# Altium project Cheeta.PrjPcb
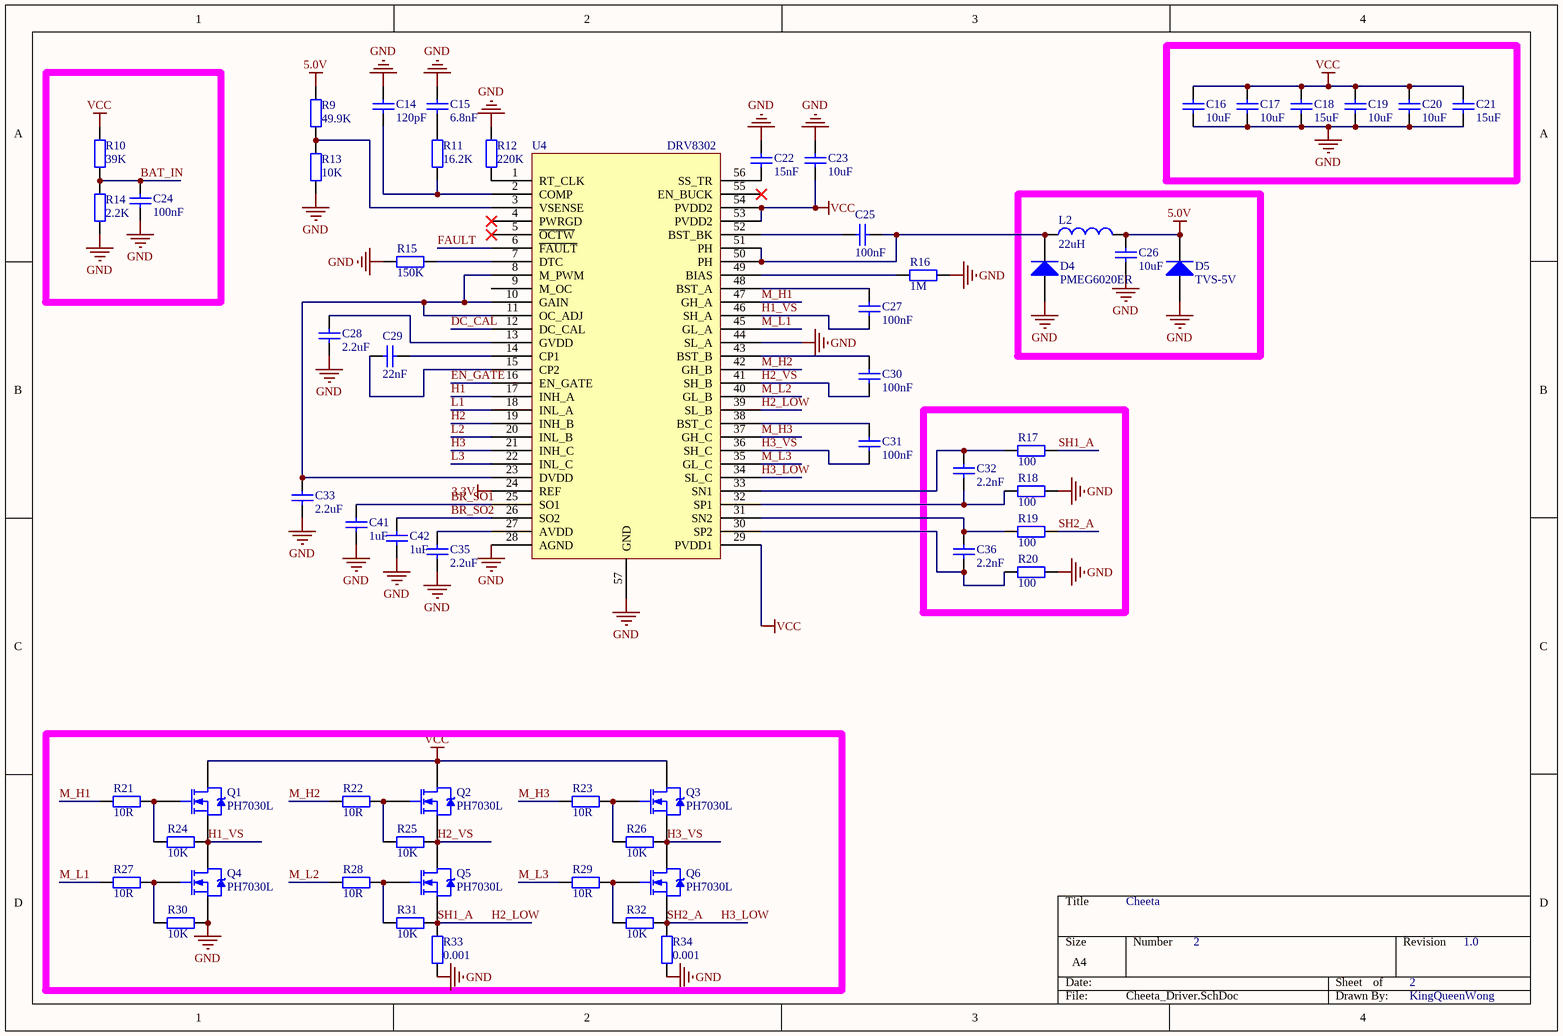
[diagram p0: Cheeta_Driver.SchDoc]
2 sheets, 120 parts. Net scope: global (net labels, ports and power ports of the same name join across sheets).
Board file: Cheeta.PcbDoc
Sheets:
  Cheeta_Driver.SchDoc
  Cheeta_Controller.SchDoc

## Sheet Cheeta_Driver.SchDoc
size A4

### Parts
C14  value 120pF  [0603C]  (hidden comment: Cap)
C15  value 6.8nF  [0603C]  (hidden comment: Cap)
C16  value 10uF  [C1206]  (hidden comment: Cap)
C17  value 10uF  [C1206]  (hidden comment: Cap)
C18  value 15uF  [2220]  (hidden comment: Cap)
C19  value 10uF  [C1206]  (hidden comment: Cap)
C20  value 10uF  [C1206]  (hidden comment: Cap)
C21  value 15uF  [2220]  (hidden comment: Cap)
C22  value 15nF  [0603C]  (hidden comment: Cap)
C23  value 10uF  [C1206]  (hidden comment: Cap)
C24  value 100nF  [0603C]  (hidden comment: Cap)
C25  value 100nF  [0603C]  (hidden comment: Cap)
C26  value 10uF  [C1210]  (hidden comment: Cap)
C27  value 100nF  [0603C]  (hidden comment: Cap)
C28  value 2.2uF  [0603C]  (hidden comment: Cap)
C29  value 22nF  [0603C]  (hidden comment: Cap)
C30  value 100nF  [0603C]  (hidden comment: Cap)
C31  value 100nF  [0603C]  (hidden comment: Cap)
C32  value 2.2nF  [0603C]  (hidden comment: Cap)
C33  value 2.2uF  [0603C]  (hidden comment: Cap)
C35  value 2.2uF  [0603C]  (hidden comment: Cap)
C36  value 2.2nF  [0603C]  (hidden comment: Cap)
C41  value 1uF  [0603C]  (hidden comment: Cap)
C42  value 1uF  [0603C]  (hidden comment: Cap)
D4  PMEG6020ER  [SMA]
D5  TVS-5V  [SMB]
L2  value 22uH  [CD43]  (hidden comment: Inductor)
Q1  PH7030L  [SOT669]
Q2  PH7030L  [SOT669]
Q3  PH7030L  [SOT669]
Q4  PH7030L  [SOT669]
Q5  PH7030L  [SOT669]
Q6  PH7030L  [SOT669]
R9  value 49.9K  [0603R]  (hidden comment: Res2)
R10  value 39K  [0603R]  (hidden comment: Res2)
R11  value 16.2K  [0603R]  (hidden comment: Res2)
R12  value 220K  [0603R]  (hidden comment: Res2)
R13  value 10K  [0603R]  (hidden comment: Res2)
R14  value 2.2K  [0603R]  (hidden comment: Res2)
R15  value 150K  [0603R]  (hidden comment: Res2)
R16  value 1M  [0603R]  (hidden comment: Res2)
R17  value 100  [0603R]  (hidden comment: Res2)
R18  value 100  [0603R]  (hidden comment: Res2)
R19  value 100  [0603R]  (hidden comment: Res2)
R20  value 100  [0603R]  (hidden comment: Res2)
R21  value 10R  [0603R]  (hidden comment: Res2)
R22  value 10R  [0603R]  (hidden comment: Res2)
R23  value 10R  [0603R]  (hidden comment: Res2)
R24  value 10K  [0603R]  (hidden comment: Res2)
R25  value 10K  [0603R]  (hidden comment: Res2)
R26  value 10K  [0603R]  (hidden comment: Res2)
R27  value 10R  [0603R]  (hidden comment: Res2)
R28  value 10R  [0603R]  (hidden comment: Res2)
R29  value 10R  [0603R]  (hidden comment: Res2)
R30  value 10K  [0603R]  (hidden comment: Res2)
R31  value 10K  [0603R]  (hidden comment: Res2)
R32  value 10K  [0603R]  (hidden comment: Res2)
R33  value 0.001  [2512]  (hidden comment: Res2)
R34  value 0.001  [2512]  (hidden comment: Res2)
U4  DRV8302  [DGG056_L]

### Nets
3.3V: U4.24(REF)
5.0V: C26.1 D5.2(K) L2.2 R9.1
GND: C14.2 C15.2 C16.2 C17.2 C18.2 C19.2 C20.2 C21.2 C22.2 C23.2 C24.1 C26.2 C28.2 C33.1 C35.1 C41.1 C42.1 D4.1(A) D5.1(A) Q4.3(S) R12.1 R13.2 R14.2 R15.1 R16.1 R18.1 R20.1 R30.1 R33.2 R34.1 U4.28(AGND) U4.44(SL_A) U4.57(GND)
VCC: C16.1 C17.1 C18.1 C19.1 C20.1 C21.1 C23.1 Q1.2(D) Q2.2(D) Q3.2(D) R10.1 U4.29(PVDD1) U4.53(PVDD2) U4.54(PVDD2)
BAT_IN: C24.2 R10.2 R14.1
BR_SO1: C41.2 U4.25(SO1)
BR_SO2: C42.2 U4.26(SO2)
DC_CAL: U4.12(DC_CAL)
EN_GATE: U4.16(EN_GATE)
FAULT: U4.6(~{FAULT})
H1: U4.17(INH_A)
H1_VS: C27.2 Q1.3(S) Q4.2(D) R24.1 U4.46(SH_A)
H2: U4.19(INH_B)
H2_LOW: Q5.3(S) R17.1 R31.2 R33.1 U4.39(SL_B)  [also labelled SH1_A]
H2_VS: C30.2 Q2.3(S) Q5.2(D) R25.1 U4.41(SH_B)
H3: U4.21(INH_C)
H3_LOW: Q6.3(S) R19.1 R32.1 R34.2 U4.34(SL_C)  [also labelled SH2_A]
H3_VS: C31.2 Q3.3(S) Q6.2(D) R26.1 U4.36(SH_C)
L1: U4.18(INL_A)
L2: U4.20(INL_B)
L3: U4.22(INL_C)
M_H1: R21.2 U4.47(GH_A)
M_H2: R22.2 U4.42(GH_B)
M_H3: R23.2 U4.37(GH_C)
M_L1: R27.2 U4.45(GL_A)
M_L2: R28.2 U4.40(GL_B)
M_L3: R29.2 U4.35(GL_C)
NetC14_1: C14.1 R11.2 U4.2(COMP)
NetC15_1: C15.1 R11.1
NetC22_1: C22.1 U4.56(SS_TR)
NetC25_1: C25.1 U4.52(BST_BK)
NetC25_2: C25.2 D4.2(K) L2.1 U4.50(PH) U4.51(PH)
NetC27_1: C27.1 U4.48(BST_A)
NetC28_1: C28.1 U4.13(GVDD)
NetC29_1: C29.1 U4.15(CP2)
NetC29_2: C29.2 U4.14(CP1)
NetC30_1: C30.1 U4.43(BST_B)
NetC31_1: C31.1 U4.38(BST_C)
NetC32_1: C32.1 R18.2 U4.32(SP1)
NetC32_2: C32.2 R17.2 U4.33(SN1)
NetC33_2: C33.2 U4.8(M_PWM) U4.10(GAIN) U4.11(OC_ADJ) U4.23(DVDD)
NetC35_2: C35.2 U4.27(AVDD)
NetC36_1: C36.1 R20.2 U4.30(SP2)
NetC36_2: C36.2 R19.2 U4.31(SN2)
NetQ1_1: Q1.1(G) R21.1 R24.2
NetQ2_1: Q2.1(G) R22.1 R25.2
NetQ3_1: Q3.1(G) R23.1 R26.2
NetQ4_1: Q4.1(G) R27.1 R30.2
NetQ5_1: Q5.1(G) R28.1 R31.1
NetQ6_1: Q6.1(G) R29.1 R32.2
NetR9_2: R9.2 R13.1 U4.3(VSENSE)
NetR12_2: R12.2 U4.1(RT_CLK)
NetR15_2: R15.2 U4.7(DTC)
NetR16_2: R16.2 U4.49(BIAS)

Not connected (* = marked no-connect by the designer): U4 4(PWRGD)* 5(~{OCTW})* 9(M_OC) 55(EN_BUCK)*

### Notes on the sheet
- Cheeta
- 2
- 1.0
- KingQueenWong

### Library data of the parts
C14-C33 C35 C36 C41 C42 = Cap: Capacitor; Published: 8-Jun-2000; LatestRevisionDate: 17-Jul-2002; LatestRevisionNote: Re-released for DXP Platform.; PackageReference: RAD-0.3; Publisher: Altium Limited; PackageDescription: Radial Cap, Thru-Hole; 2 Leads; 0.3 in Pin Spacing
D4 D5 = Diode: Default Diode; Published: 8-Jun-2000; LatestRevisionDate: 17-Jul-2002; LatestRevisionNote: Re-released for DXP Platform.; PackageVersion: Sep-1996; PackageReference: SMC; Publisher: Altium Limited; PackageDescription: DO-214-AB/SMC; 2 C-Bend Leads; Body 7.9 x 5.9 mm, inc. leads (LxW); Code_JEDEC: DO-214-AB
L2 = Inductor: Code_IEC: 1005; Published: 8-Jun-2000; LatestRevisionDate: 29-May-2009; LatestRevisionNote: IPC-7351 Footprint Added.; PackageReference: 0402-A; Publisher: Altium Limited; PackageDescription: Chip Inductor; Code_JEITA: 0402
Q1-Q6 = PH7030L: HEXFET Power MOSFET; Published: 17-Sep-2003; LatestRevisionDate: 20-Nov-2009; LatestRevisionNote: IPC-7351 Footprint Added.; DatasheetVersion: 16-Mar-2001; PackageReference: D2PAK; Publisher: Altium Limited; PackageDescription: 3-Pin Transistor Outline Package 2.54 mm Pitch, 15.1 mm Lead Span; ComponentLink1Description: Manufacturer Link; ComponentLink1URL: http://www.irf.com/; ComponentLink2Description: Datasheet; ComponentLink2URL: http://www.irf.com/product-info/datasheets/data/IRFR2405.pdf
R9-R34 = Res2: Resistor; Published: 8-Jun-2000; LatestRevisionDate: 17-Jul-2002; LatestRevisionNote: Re-released for DXP Platform.; PackageReference: AXIAL-0.4; Publisher: Altium Limited; PackageDescription: Axial Device, Thru-Hole; 2 Leads; 0.4 in Pin Spacing

## Sheet Cheeta_Controller.SchDoc
size A4
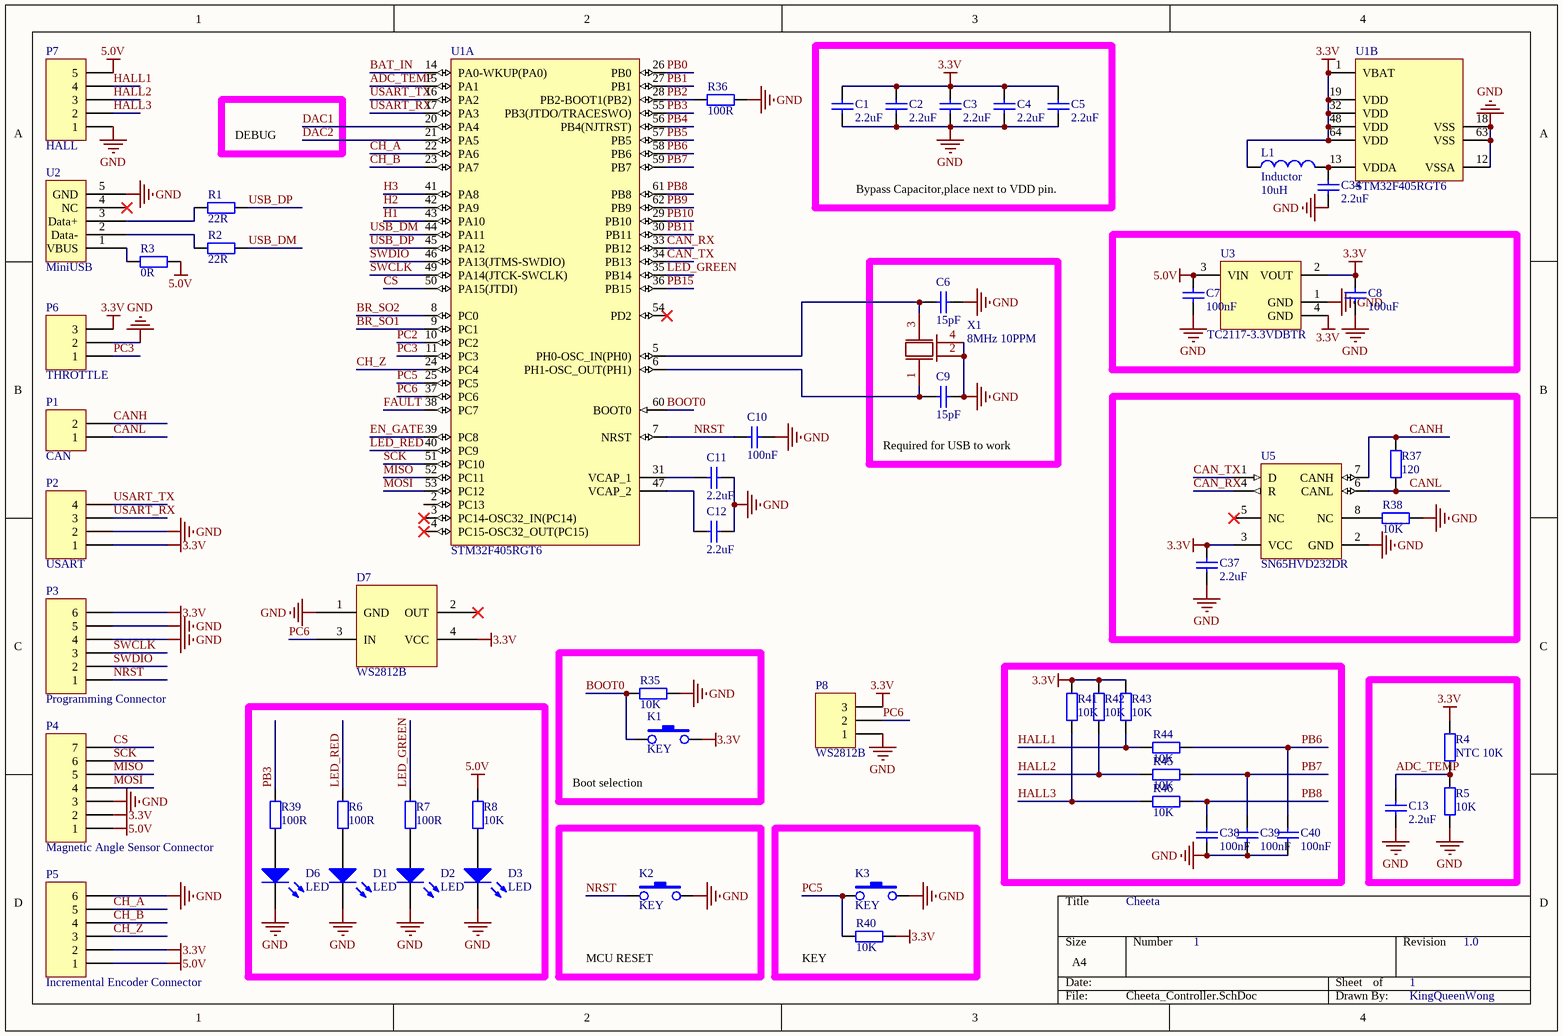
[diagram p1: Cheeta_Controller.SchDoc]

### Parts
C1  value 2.2uF  [0603C]  (hidden comment: Cap)
C2  value 2.2uF  [0603C]  (hidden comment: Cap)
C3  value 2.2uF  [0603C]  (hidden comment: Cap)
C4  value 2.2uF  [0603C]  (hidden comment: Cap)
C5  value 2.2uF  [0603C]  (hidden comment: Cap)
C6  value 15pF  [0603C]  (hidden comment: Cap)
C7  value 100nF  [0603C]  (hidden comment: Cap)
C8  value 100uF  [C1210]  (hidden comment: Cap)
C9  value 15pF  [0603C]  (hidden comment: Cap)
C10  value 100nF  [0603C]  (hidden comment: Cap)
C11  value 2.2uF  [0603C]  (hidden comment: Cap)
C12  value 2.2uF  [0603C]  (hidden comment: Cap)
C13  value 2.2uF  [0603C]  (hidden comment: Cap)
C34  value 2.2uF  [0603C]  (hidden comment: Cap)
C37  value 2.2uF  [0603C]  (hidden comment: Cap)
C38  value 100nF  [0603C]  (hidden comment: Cap)
C39  value 100nF  [0603C]  (hidden comment: Cap)
C40  value 100nF  [0603C]  (hidden comment: Cap)
D1  LED  [0603D]
D2  LED  [0603D]
D3  LED  [0603D]
D6  LED  [0603D]
D7  WS2812B  [WS2812B]
K1  KEY  [KEY3*4]
K2  KEY  [KEY3*4]
K3  KEY  [KEY3*4]
L1  Inductor  value 10uH  [0603C]
P1  CAN  [SH1.0_2P]
P2  USART  [SH1.0_4P]
P3  Programming Connector  [SH1.0_6P]
P4  Magnetic Angle Sensor Connector  [SH1.0_7P]
P5  Incremental Encoder Connector  [SH1.0_6P]
P6  THROTTLE  [SH1.0_3P]
P7  HALL  [SH1.0_5P]
P8  WS2812B  [SH1.0_3P]
R1  value 22R  [0603R]  (hidden comment: Res2)
R2  value 22R  [0603R]  (hidden comment: Res2)
R3  value 0R  [0603R]  (hidden comment: Res2)
R4  value NTC 10K  [0603R]  (hidden comment: Res2)
R5  value 10K  [0603R]  (hidden comment: Res2)
R6  value 100R  [0603R]  (hidden comment: Res2)
R7  value 100R  [0603R]  (hidden comment: Res2)
R8  value 10K  [0603R]  (hidden comment: Res2)
R35  value 10K  [0603R]  (hidden comment: Res2)
R36  value 100R  [0603R]  (hidden comment: Res2)
R37  value 120  [0603R]  (hidden comment: Res2)
R38  value 10K  [0603R]  (hidden comment: Res2)
R39  value 100R  [0603R]  (hidden comment: Res2)
R40  value 10K  [0603R]  (hidden comment: Res2)
R41  value 10K  [0603R]  (hidden comment: Res2)
R42  value 10K  [0603R]  (hidden comment: Res2)
R43  value 10K  [0603R]  (hidden comment: Res2)
R44  value 10K  [0603R]  (hidden comment: Res2)
R45  value 10K  [0603R]  (hidden comment: Res2)
R46  value 10K  [0603R]  (hidden comment: Res2)
U1  STM32F405RGT6  [LQFP64]  (parts A,B of 2)
U2  MiniUSB  [MINI-USB]
U3  TC2117-3.3VDBTR  [SOT-223-DB3_N]
U5  SN65HVD232DR  [D8_L]
X1  8MHz 10PPM  [ABM3B]

### Nets
3.3V: C1.2 C2.2 C3.2 C4.2 C5.2 C8.2 C37.1 D7.4(VCC) K1.2 L1.1 P2.1 P3.6 P4.2 P5.2 P6.3 P8.3 R4.1 R40.1 R41.2 R42.2 R43.2 U1.1(VBAT) U1.19(VDD) U1.32(VDD) U1.48(VDD) U1.64(VDD) U3.2(VOUT) U3.4(GND) U5.3(VCC)
5.0V: C7.2 P4.1 P5.1 P7.5 R3.1 R8.2 U3.3(VIN)
GND: C1.1 C2.1 C3.1 C4.1 C5.1 C6.2 C7.1 C8.1 C9.2 C10.2 C11.2 C12.2 C13.1 C34.1 C37.2 C38.1 C39.1 C40.1 D1.2(K) D2.2(K) D3.2(K) D6.2(K) D7.1(GND) K2.2 K3.2 P2.2 P3.4 P3.5 P4.3 P5.6 P6.2 P7.1 P8.1 R5.2 R35.1 R36.1 R38.2 U1.12(VSSA) U1.18(VSS) U1.63(VSS) U2.5(GND) U3.1(GND) U5.2(GND) X1.2 X1.4
ADC_TEMP: C13.2 R4.2 R5.1 U1.15(PA1)
BAT_IN: U1.14(PA0-WKUP(PA0))
BOOT0: K1.1 R35.2 U1.60(BOOT0)
BR_SO1: U1.9(PC1)
BR_SO2: U1.8(PC0)
CAN_RX: U1.33(PB12) U5.4(R)
CAN_TX: U1.34(PB13) U5.1(D)
CANH: P1.2 R37.2 U5.7(CANH)
CANL: P1.1 R37.1 U5.6(CANL)
CH_A: P5.5 U1.22(PA6)
CH_B: P5.4 U1.23(PA7)
CH_Z: P5.3 U1.24(PC4)
CS: P4.7 U1.50(PA15(JTDI))
DAC1: U1.20(PA4)
DAC2: U1.21(PA5)
EN_GATE: U1.39(PC8)
FAULT: U1.38(PC7)
H1: U1.43(PA10)
H2: U1.42(PA9)
H3: U1.41(PA8)
HALL1: P7.4 R43.1 R44.2
HALL2: P7.3 R42.1 R45.2
HALL3: P7.2 R41.1 R46.2
LED_GREEN: R7.2 U1.35(PB14)
LED_RED: R6.2 U1.40(PC9)
MISO: P4.5 U1.52(PC11)
MOSI: P4.4 U1.53(PC12)
NRST: C10.1 K2.1 P3.1 U1.7(NRST)
PB0: U1.26(PB0)
PB1: U1.27(PB1)
PB2: R36.2 U1.28(PB2-BOOT1(PB2))
PB3: R39.2 U1.55(PB3(JTDO/TRACESWO))
PB4: U1.56(PB4(NJTRST))
PB5: U1.57(PB5)
PB6: C40.2 R44.1 U1.58(PB6)
PB7: C39.2 R45.1 U1.59(PB7)
PB8: C38.2 R46.1 U1.61(PB8)
PB9: U1.62(PB9)
PB10: U1.29(PB10)
PB11: U1.30(PB11)
PB15: U1.36(PB15)
PC2: U1.10(PC2)
PC3: P6.1 U1.11(PC3)
PC5: K3.1 R40.2 U1.25(PC5)
PC6: D7.3(IN) P8.2 U1.37(PC6)
SCK: P4.6 U1.51(PC10)
SWCLK: P3.3 U1.49(PA14(JTCK-SWCLK))
SWDIO: P3.2 U1.46(PA13(JTMS-SWDIO))
USART_RX: P2.3 U1.17(PA3)
USART_TX: P2.4 U1.16(PA2)
USB_DM: R2.1 U1.44(PA11)
USB_DP: R1.1 U1.45(PA12)
NetC6_1: C6.1 U1.5(PH0-OSC_IN(PH0)) X1.3
NetC9_1: C9.1 U1.6(PH1-OSC_OUT(PH1)) X1.1
NetC11_1: C11.1 U1.31(VCAP_1)
NetC12_1: C12.1 U1.47(VCAP_2)
NetC34_2: C34.2 L1.2 U1.13(VDDA)
NetD1_1: D1.1(A) R6.1
NetD2_1: D2.1(A) R7.1
NetD3_1: D3.1(A) R8.1
NetD6_1: D6.1(A) R39.1
NetR1_2: R1.2 U2.3(Data+)
NetR2_2: R2.2 U2.2(Data-)
NetR3_2: R3.2 U2.1(VBUS)
NetR38_1: R38.1 U5.8(NC)

Not connected (* = marked no-connect by the designer): D7 2(OUT)*; U1 2(PC13) 3(PC14-OSC32_IN(PC14))* 4(PC15-OSC32_OUT(PC15))* 54(PD2)*; U2 4(NC)*; U5 5(NC)*

### Notes on the sheet
- DEBUG
- Bypass Capacitor,place next to VDD pin.
- (near C9) Required for USB to work
- (near K1) Boot selection
- Cheeta
- MCU RESET
- (near R40) KEY
- 1
- 1.0
- KingQueenWong

### Library data of the parts
C1-C13 C34 C37-C40 = Cap: Capacitor; Published: 8-Jun-2000; LatestRevisionDate: 17-Jul-2002; LatestRevisionNote: Re-released for DXP Platform.; PackageReference: RAD-0.3; Publisher: Altium Limited; PackageDescription: Radial Cap, Thru-Hole; 2 Leads; 0.3 in Pin Spacing
D1-D3 D6 = LED0: Typical INFRARED GaAs LED; Published: 8-Jun-2000; LatestRevisionDate: 08-Jul-2005; LatestRevisionNote: Mech Layer 1 removed.; PackageReference: LED-0; Publisher: Altium Limited; PackageDescription: LED; 2 Leads
L1 = Inductor: Code_IEC: 1005; Published: 8-Jun-2000; LatestRevisionDate: 29-May-2009; LatestRevisionNote: IPC-7351 Footprint Added.; PackageReference: 0402-A; Publisher: Altium Limited; PackageDescription: Chip Inductor; Code_JEITA: 0402
P1 = Header 2: Header, 2-Pin; LatestRevisionDate: 17-Jul-2002; LatestRevisionNote: Re-released for DXP Platform.; Publisher: Altium Limited
P2 = MHDR1X4: Header, 4-Pin; LatestRevisionDate: 17-Jul-2002; LatestRevisionNote: Re-released for DXP Platform.; Publisher: Altium Limited
P3 P5 = MHDR1X6: Header, 6-Pin; LatestRevisionDate: 17-Jul-2002; LatestRevisionNote: Re-released for DXP Platform.; Publisher: Altium Limited
P4 = MHDR1X7: Header, 7-Pin; LatestRevisionDate: 17-Jul-2002; LatestRevisionNote: Re-released for DXP Platform.; Publisher: Altium Limited
P6 P8 = Header 3: Header, 3-Pin; LatestRevisionDate: 17-Jul-2002; LatestRevisionNote: Re-released for DXP Platform.; Publisher: Altium Limited
P7 = Header 5: Header, 5-Pin; LatestRevisionDate: 17-Jul-2002; LatestRevisionNote: Re-released for DXP Platform.; Publisher: Altium Limited
R1-R8 R35-R46 = Res2: Resistor; Published: 8-Jun-2000; LatestRevisionDate: 17-Jul-2002; LatestRevisionNote: Re-released for DXP Platform.; PackageReference: AXIAL-0.4; Publisher: Altium Limited; PackageDescription: Axial Device, Thru-Hole; 2 Leads; 0.4 in Pin Spacing
U1 = STM32F405RGT6: ARM Cortex-M4 32-bit MCU+FPU, 210 DMIPS, 1024 kB Flash, 192 kB Internal RAM, 51 I/Os, 64-pin LQFP, -40 to 85 degC, Tray; Manufacturer: STMicroelectronics; D/A Converter: 2x12-bit; FLASH Size (Prog) (kB): 1024; I/Os (High Current): 51; Internal RAM Size (kB): 192; Operating Frequency(F) (Processor speed) (MHz): 168; Supply Voltage(Vcc) max (V): 3.6; Supply Voltage(Vcc) min (V): 1.8; DatasheetVersion: Rev. 4; PackageVersion: Rev. 4, 06/2013; PackageReference: LQFP64; PackageDescription: 64-Pin Low Profile Quad Flat Package, 10 x 10 mm Body, 0.5 mm Pitch; Supplier 1: Digi-Key; Supplier Part Number 1: 497-11767-ND; Supplier 2: Farnell; Supplier Part Number 2: 2064363; Supplier 3: Newark; Supplier Part Number 3: 73T2329; Supplier 4: Mouser; Supplier Part Number 4: 511-STM32F405RGT6; Core: ARM Cortex-M4; Packing: Tray; Mounting Technology: Surface Mount; PartNumber: STM32F405RGT6; ComponentLink1Description: Manufacturer URL; ComponentLink1URL: http://www.st.com/web/en/home.html; ComponentLink2Description: Datasheet; ComponentLink2URL: http://www.st.com/st-web-ui/static/active/en/resource/technical/document/datasheet/DM00037051.pdf; ComponentLink3Description: Package Specification; ComponentLink3URL: http://www.st.com/st-web-ui/static/active/en/resource/technical/document/datasheet/DM00037051.pdf
U3 = TC2117-3.3VDBTR: 800 mA Fixed Low Dropout Positive Regulator, 3-Pin SOT-223, Extended Temperature, Tape and Reel; Manufacturer: Microchip; DatasheetVersion: revC, Oct-2006; PackageVersion: revBB, Aug-2009; PackageReference: SOT-223-DB3; PackageDescription: 3-Lead Plastic Small Outline Transistor (DB) [SOT-223]; Supplier 1: Digi-Key; Supplier Part Number 1: TC2117-3.3VDBTR-ND; Supplier 2: Farnell; Supplier Part Number 2: 1605581RL; Supplier 3: Farnell; Supplier Part Number 3: 1605581; Supplier 4: Newark; Supplier Part Number 4: 11N8302; Supplier 5: Mouser; Supplier Part Number 5: 579-TC2117-3.3VDBTR; Mounting Technology: Surface Mount; PartNumber: TC2117-3.3VDBTR; ComponentLink1Description: Manufacturer URL; ComponentLink1URL: http://www.microchip.com/; ComponentLink2Description: Datasheet; ComponentLink2URL: http://ww1.microchip.com/downloads/en/DeviceDoc/21665c.pdf; ComponentLink3Description: Package Specification; ComponentLink3URL: http://www.microchip.com/stellent/groups/techpub_sg/documents/packagingspec/en012702.pdf
U5 = SN65HVD232DR: 3.3 V Can Transceiver, 17 mA, -40 to 85 degC, 8-pin SOIC (D), Green (RoHS & no Sb/Br); Manufacturer: Texas Instruments; Drivers Per Package: 1; Transient Pulse Protection(V): -25 to 25; ICC(Max)(mA): 17; Supply Voltage(s)(V): 3.3; Rating: Catalog; DatasheetVersion: SLOS346K; PackageVersion: revM, Jun-2011; PackageReference: D8; PackageDescription: 8-Pin Plastic Small Outline Integrated Circuit, 4.9 x 3.9 mm, Pitch 1.27 mm Pitch; Supplier 1: Digi-Key; Supplier Part Number 1: 296-26344-2-ND; Supplier 2: Digi-Key; Supplier Part Number 2: 296-26344-1-ND; Supplier 3: Digi-Key; Supplier Part Number 3: 296-26344-6-ND; Supplier 4: Newark; Supplier Part Number 4: 75C7753; Supplier 5: Mouser; Supplier Part Number 5: 595-SN65HVD232DR; Eco-Plan: Green (RoHS & no Sb/Br); SubFamily: CAN; Receivers Per Package: 1; Isolated: No; Footprint: SN65HVD232; Mounting Technology: Surface Mount; PartNumber: SN65HVD232DR; Code_JEDEC: MS-012AA; ComponentLink1Description: Datasheet; ComponentLink1URL: http://www.ti.com/general/docs/lit/getliterature.tsp?genericPartNumber=SN65HVD232&fileType=pdf
X1 = TZ1430A: Crystal Oscillator

## Nets that join several sheets
3.3V: Cheeta_Driver (U4.24), Cheeta_Controller (29 pins)
5.0V: Cheeta_Driver (C26.1 D5.2 L2.2 R9.1), Cheeta_Controller (7 pins)
GND: Cheeta_Driver (33 pins), Cheeta_Controller (45 pins)
BAT_IN: Cheeta_Driver (C24.2 R10.2 R14.1), Cheeta_Controller (U1.14)
BR_SO1: Cheeta_Driver (C41.2 U4.25), Cheeta_Controller (U1.9)
BR_SO2: Cheeta_Driver (C42.2 U4.26), Cheeta_Controller (U1.8)
EN_GATE: Cheeta_Driver (U4.16), Cheeta_Controller (U1.39)
FAULT: Cheeta_Driver (U4.6), Cheeta_Controller (U1.38)
H1: Cheeta_Driver (U4.17), Cheeta_Controller (U1.43)
H2: Cheeta_Driver (U4.19), Cheeta_Controller (U1.42)
H3: Cheeta_Driver (U4.21), Cheeta_Controller (U1.41)